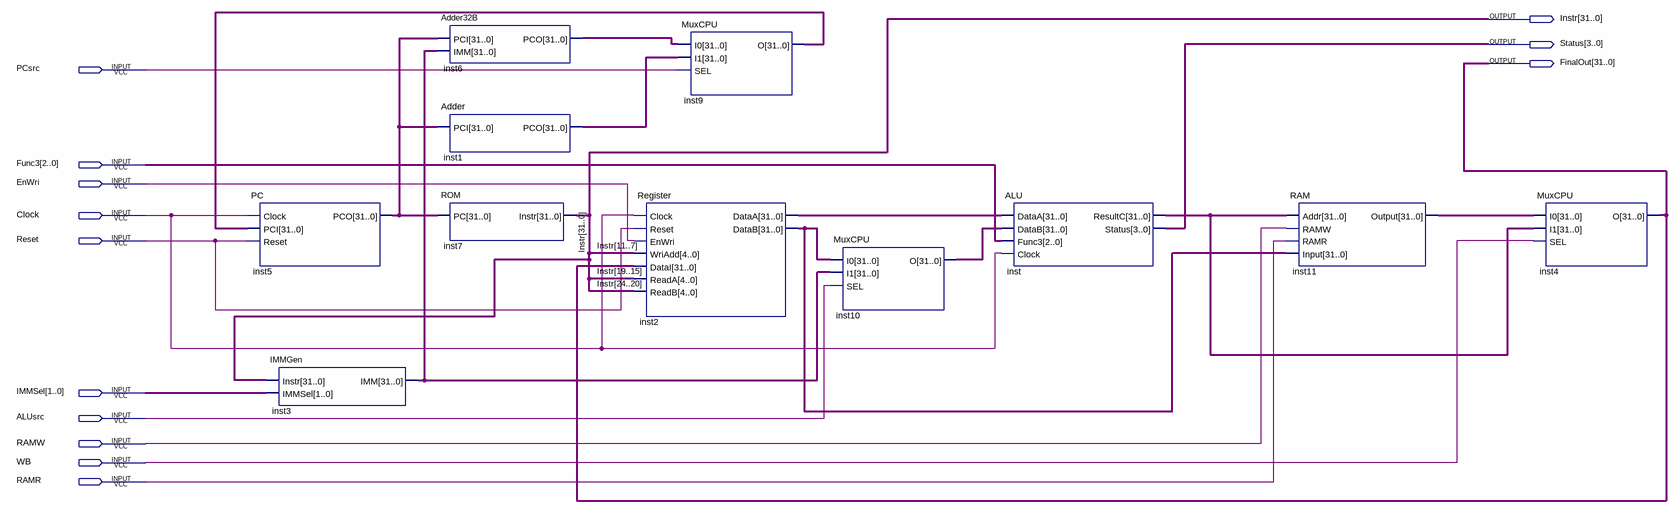
[diagram p0: schematic sheet]
// Quartus schematic CPU.bdf as structural Verilog: 11 symbols, 13 pins
module CPU (
  input  PCsrc,
  input  [2:0] Func3,
  input  EnWri,
  input  Clock,
  input  Reset,
  input  [1:0] IMMSel,
  input  ALUsrc,
  input  RAMW,
  input  WB,
  input  RAMR,
  output [31:0] Instr,
  output [3:0] Status,
  output [31:0] FinalOut
);

  wire [31:0] inst1_pco, inst2_dataa, inst2_datab, inst3_imm, inst5_pco, inst6_pco, inst9_o, inst10_o,
       inst11_output, inst_resultc;

  PC inst5 (.PCI(inst9_o), .Reset(Reset), .Clock(Clock), .PCO(inst5_pco));
  IMMGen inst3 (.Instr(Instr), .IMMSel(IMMSel), .IMM(inst3_imm));
  Adder32B inst6 (.PCI(inst5_pco), .IMM(inst3_imm), .PCO(inst6_pco));
  Adder inst1 (.PCI(inst5_pco), .PCO(inst1_pco));
  ROM inst7 (.PC(inst5_pco), .Instr(Instr));
  Register inst2 (
    .Clock(Clock), .Reset(Reset), .EnWri(EnWri), .WriAdd(Instr[11:7]), .DataI(FinalOut),
    .ReadA(Instr[19:15]), .ReadB(Instr[24:20]), .DataA(inst2_dataa), .DataB(inst2_datab));
  MuxCPU inst9 (.I0(inst6_pco), .I1(inst1_pco), .SEL(PCsrc), .O(inst9_o));
  MuxCPU inst10 (.I0(inst2_datab), .I1(inst3_imm), .SEL(ALUsrc), .O(inst10_o));
  ALU inst (
    .DataA(inst2_dataa), .DataB(inst10_o), .Func3(Func3), .Clock(Clock), .ResultC(inst_resultc),
    .Status(Status));
  RAM inst11 (.Addr(inst_resultc), .RAMW(RAMW), .RAMR(RAMR), .Input(inst2_datab), .Output(inst11_output));
  MuxCPU inst4 (.I0(inst11_output), .I1(inst_resultc), .SEL(WB), .O(FinalOut));
endmodule
